# Altium schematic sheet OpenBMS.SchDoc: OpenBMS Parent schematic
size 420 x 297 mm; Title2: OpenBMS; Project: OpenBMS; DSN_APP_DATE: --/--/--; CHK_APP_DATE: --/--/--; ApprovedBy: 1; CheckedBy: 1; Author: Kayoum Djedidi; CompanyName: ISIMM; DrawnBy: Kayoum Djedidi; DocumentNumber: 1; Revision: 0; SheetNumber: 1; SheetTotal: 5; ImagePath: 1
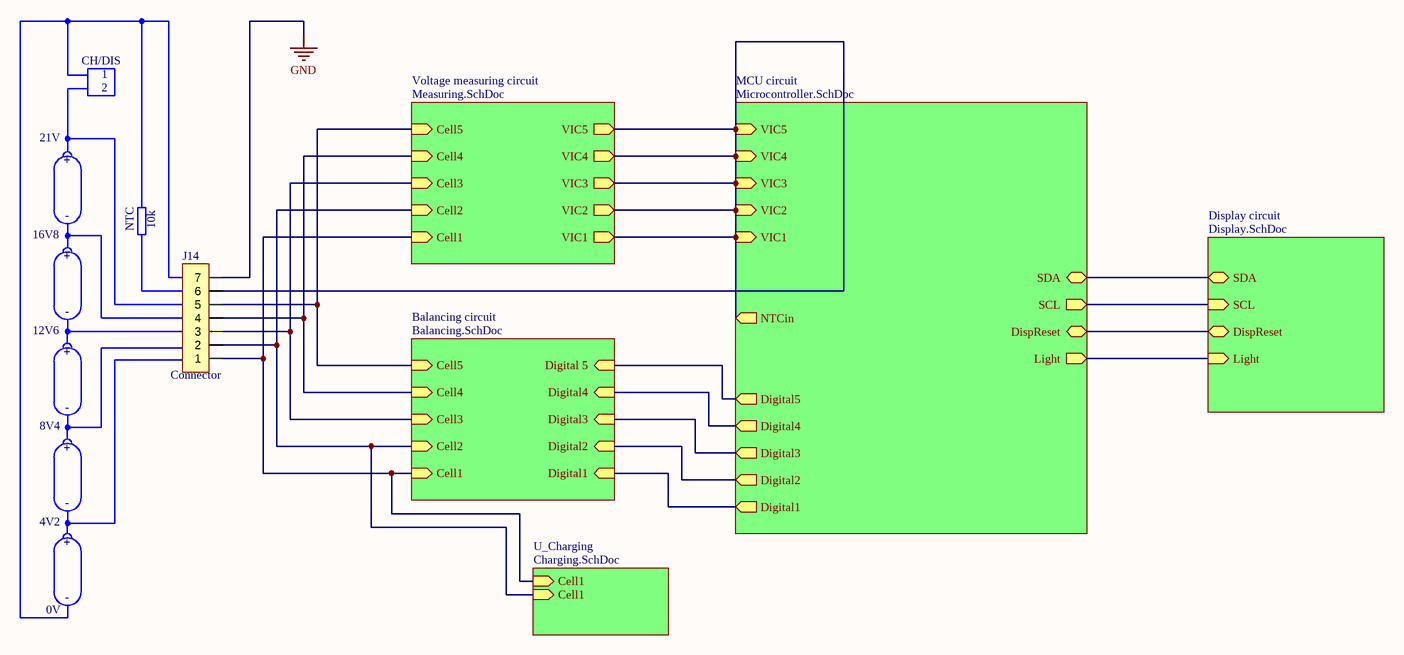
[diagram p0: OpenBMS.SchDoc]

## Parts
J14  Name: Connector  [HDR_1x7_2.54mm-MALE]  (hidden comment: Header connector 1x7)

## Sub-sheets
Balancing circuit = Balancing.SchDoc: Cell1 (in), Cell2 (in), Cell3 (in), Cell4 (in), Cell5 (in), Digital 5 (in), Digital4 (in), Digital3 (in), Digital2 (in), Digital1 (in)
Display circuit = Display.SchDoc: Light (in), DispReset (bidir), SCL (in), SDA (bidir)
MCU circuit = Microcontroller.SchDoc: VIC5 (in), VIC4 (in), VIC3 (in), VIC2 (in), VIC1 (in), Digital5 (out), Digital4 (out), Digital3 (out), Digital2 (out), Digital1 (out), SDA (bidir), SCL (out), DispReset (bidir), Light (out), NTCin (out)
U_Charging = Charging.SchDoc: Cell1 (in), Cell1 (in)
Voltage measuring circuit = Measuring.SchDoc: Cell5 (in), Cell4 (in), Cell3 (in), Cell2 (in), Cell1 (in), VIC5 (out), VIC4 (out), VIC3 (out), VIC2 (out), VIC1 (out)

## Nets
GND: J14.7
NetJ14_1: J14.1 ; sheet Balancing circuit/Cell1, sheet Voltage measuring circuit/Cell1, sheet U_Charging/Cell1
NetJ14_2: J14.2 ; sheet Balancing circuit/Cell2, sheet Voltage measuring circuit/Cell2, sheet U_Charging/Cell1
NetJ14_3: J14.3 ; sheet Balancing circuit/Cell3, sheet Voltage measuring circuit/Cell3
NetJ14_4: J14.4 ; sheet Balancing circuit/Cell4, sheet Voltage measuring circuit/Cell4
NetJ14_5: J14.5 ; sheet Balancing circuit/Cell5, sheet Voltage measuring circuit/Cell5
NetJ14_6: J14.6 ; sheet Voltage measuring circuit/VIC5, sheet Voltage measuring circuit/VIC4, sheet Voltage measuring circuit/VIC3, sheet Voltage measuring circuit/VIC2, sheet Voltage measuring circuit/VIC1, sheet MCU circuit/VIC5, sheet MCU circuit/VIC4, sheet MCU circuit/VIC3, sheet MCU circuit/VIC2, sheet MCU circuit/VIC1, sheet MCU circuit/NTCin
(unnamed): sheet Balancing circuit/Digital 5, sheet MCU circuit/Digital5
(unnamed): sheet Balancing circuit/Digital4, sheet MCU circuit/Digital4
(unnamed): sheet Balancing circuit/Digital3, sheet MCU circuit/Digital3
(unnamed): sheet Balancing circuit/Digital2, sheet MCU circuit/Digital2
(unnamed): sheet Balancing circuit/Digital1, sheet MCU circuit/Digital1
(unnamed): sheet MCU circuit/SDA, sheet Display circuit/SDA
(unnamed): sheet MCU circuit/SCL, sheet Display circuit/SCL
(unnamed): sheet MCU circuit/DispReset, sheet Display circuit/DispReset
(unnamed): sheet MCU circuit/Light, sheet Display circuit/Light

## Notes on the sheet
- CH/DIS
- 1
- 21V
- 2
- +
- -
- 16V8
- NTC
- 10k
- 12V6
- 8V4
- 4V2
- 0V
- THIS DOCUMENT AND THE DATA DISCLOSED HEREIN OR
- HEREWITH IS THE PROPERTY OF ALTIUM LIMITED AND MAY
- DWG NO:
- REVISION
- REV:
- DESCRIPTION
- DATE
- APPROVED
- BE FREELY DISTRIBUTED IN WHOLE. NO RIGHTS ARE
- RESERVED OR EXPRESS OR IMPLIED WARANTEE GIVEN.
- ENG:
- APPROVALS
- PROJECT
- DSN:
- CHK:
- REFERENCE DOCUMENTS
- PROJECT REVISION:
- TITLE
- DOCUMENT REVISION:
- DESIGN ITEM:
- BOM:
- FAB DWG:
- PCB DWG:
- ASSY DWG:
- SCALE:
- A3
- SIZE
- CAGE CODE
- FILE NAME
- DWG NO.
- SHEET
- OF
- REV

## Library data of the parts
J14 = Header connector 1x7: Header, 7-Pin [TH]; Manufacturer: Molex; Manufacturer Part Number: 70543-0006; Contact Resistance: 30mR; Current Rating: 3A; Gender: Male; Glow Wire Compliant: Non-compliant; Number of Circuits: 7; Pitch: 2.54mm; Voltage Rating: 250V; LatestRevisionDate: 17-Jul-2002; LatestRevisionNote: Re-released for DXP Platform.; Publisher: Altium Limited; ComponentLink1Description: Male_DATASHEET; ComponentLink1URL: https://hr.mouser.com/datasheet/2/276/1/0705430006_PCB_HEADERS-172671.pdf; ComponentLink2Description: Male_BUY; ComponentLink2URL: https://hr.mouser.com/ProductDetail/Molex/70543-0006?qs=tYx%252BZc2nXqqLGOznLgFBUw%3D%3D; ComponentLink3Description: Female_DATASHEET; ComponentLink3URL: https://hr.mouser.com/datasheet/2/276/0014600072_RB_CBL_WR_TRP_CONN-157136.pdf; ComponentLink4Description: Female_BUY; ComponentLink4URL: https://hr.mouser.com/ProductDetail/Molex/14-60-0072?qs=NB3s7TNnM%252BbcvQdqxWlaYA%3D%3D; Supplier 1: Mouser; Supplier Part Number 1: 538-70543-0006; Color: Black; Contact Material: Bronze,Copper Alloy; Contact Plating: Gold; ELV: Compliant; Flammability Rating: UL94 V-0; Housing Color: Black; Housing Material: Thermoplastic; Lead Free: Lead Free; Material: Brass; Max Operating Temperature: 105°C; Min Operating Temperature: -40°C; Mount: Through Hole; Number of Contacts: 7; Number of Positions: 7; Number of Rows: 1; Orientation: Vertical; Package Quantity: 1248; Packaging: Rail/Tube; Radiation Hardening: No; REACH SVHC: Unknown; RoHS Compliant: Yes; Series: 70543; Termination: Through Hole; Supplier Packaging 1: Tube; Supplier Unit Price 1: $1.68; Supplier Location 1: US